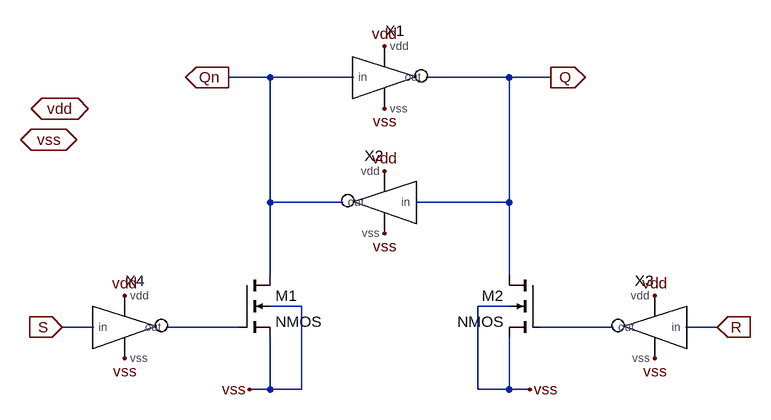
[diagram p0: schematic Draft14.asc]
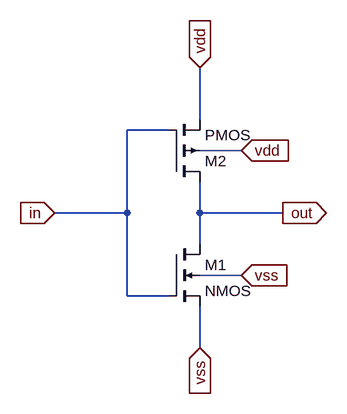
[diagram p1: sub-circuit inv_lvt.asc]
Draft14.asc, the LTspice schematic file:
Version 4
SHEET 1 880 680
WIRE 16 -144 -48 -144
WIRE 144 -144 16 -144
WIRE 384 -144 256 -144
WIRE 448 -144 384 -144
WIRE 16 48 16 -144
WIRE 128 48 16 48
WIRE 384 48 384 -144
WIRE 384 48 240 48
WIRE 16 160 16 48
WIRE 384 160 384 48
WIRE 64 208 16 208
WIRE 384 208 336 208
WIRE -256 240 -304 240
WIRE -32 240 -144 240
WIRE 544 240 432 240
WIRE 704 240 656 240
WIRE 16 336 16 256
WIRE 16 336 -16 336
WIRE 64 336 64 208
WIRE 64 336 16 336
WIRE 336 336 336 208
WIRE 384 336 384 256
WIRE 384 336 336 336
WIRE 416 336 384 336
FLAG 192 -192 vdd
FLAG 192 -96 vss
FLAG 192 0 vdd
FLAG 192 96 vss
FLAG 608 192 vdd
FLAG 608 288 vss
FLAG -208 192 vdd
FLAG -208 288 vss
FLAG 448 -144 Q
IOPIN 448 -144 Out
FLAG 704 240 R
IOPIN 704 240 In
FLAG -48 -144 Qn
IOPIN -48 -144 Out
FLAG -304 240 S
IOPIN -304 240 In
FLAG -16 336 vss
FLAG 416 336 vss
FLAG -352 -96 vdd
IOPIN -352 -96 BiDir
FLAG -368 -48 vss
IOPIN -368 -48 BiDir
SYMBOL inv_lvt 208 -144 R0
SYMATTR InstName X1
SYMBOL inv_lvt 176 48 M0
SYMATTR InstName X2
SYMBOL inv_lvt 592 240 M0
SYMATTR InstName X3
SYMBOL inv_lvt -192 240 R0
SYMATTR InstName X4
SYMBOL nmos4 -32 160 R0
SYMATTR InstName M1
SYMBOL nmos4 432 160 M0
SYMATTR InstName M2

inv_lvt.asc, the sub-circuit schematic file:
Version 4
SHEET 1 880 680
WIRE 272 -16 272 -96
WIRE 224 0 160 0
WIRE 336 32 272 32
WIRE 160 128 160 0
WIRE 160 128 48 128
WIRE 272 128 272 80
WIRE 400 128 272 128
WIRE 272 176 272 128
WIRE 336 224 272 224
WIRE 160 256 160 128
WIRE 224 256 160 256
WIRE 272 336 272 272
FLAG 272 -96 vdd
IOPIN 272 -96 In
FLAG 272 336 vss
IOPIN 272 336 In
FLAG 336 32 vdd
IOPIN 336 32 In
FLAG 336 224 vss
IOPIN 336 224 In
FLAG 400 128 out
IOPIN 400 128 Out
FLAG 48 128 in
IOPIN 48 128 In
SYMBOL nmos4 224 176 R0
SYMATTR InstName M1
SYMBOL pmos4 224 80 M180
SYMATTR InstName M2

The netlist it stands for:
* Draft14.asc
XX1 Qn vdd vss Q inv_lvt
XX2 Q vdd vss Qn inv_lvt
XX3 R vdd vss N002 inv_lvt
XX4 S vdd vss N001 inv_lvt
M1 Qn N001 vss vss NMOS
M2 Q N002 vss vss NMOS

* block symbol definitions
.subckt inv_lvt in vdd vss out
M1 out in vss vss NMOS
M2 out in vdd vdd PMOS
.ends inv_lvt

.model NMOS NMOS
.model PMOS PMOS
.lib standard.mos
.backanno
.end